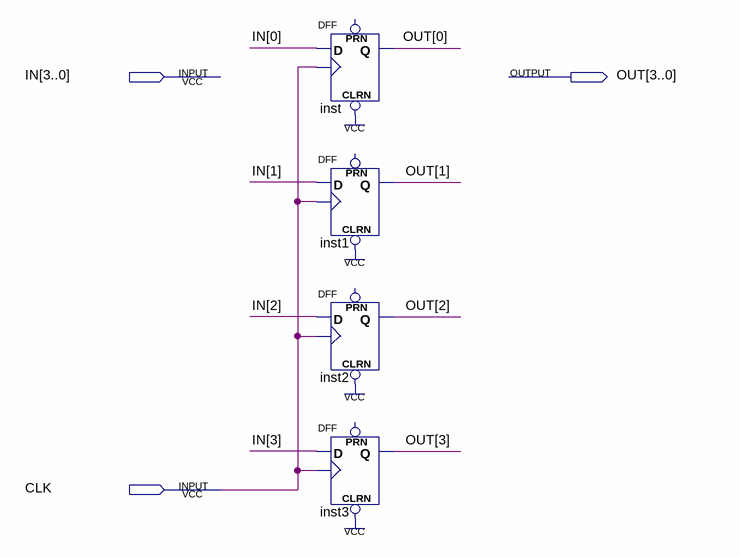
[diagram p0: schematic sheet]
// Quartus schematic registrador_4.bdf as structural Verilog: 4 symbols, 3 pins
module registrador_4 (
  input  [3:0] IN,
  input  CLK,
  output [3:0] OUT
);

  DFF inst (.CLRN(1'b1), .CLK(CLK), .D(IN[0]), .Q(OUT[0]));  // open: PRN
  DFF inst1 (.CLRN(1'b1), .CLK(CLK), .D(IN[1]), .Q(OUT[1]));  // open: PRN
  DFF inst2 (.CLRN(1'b1), .CLK(CLK), .D(IN[2]), .Q(OUT[2]));  // open: PRN
  DFF inst3 (.CLRN(1'b1), .CLK(CLK), .D(IN[3]), .Q(OUT[3]));  // open: PRN
endmodule
